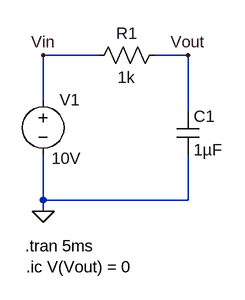
[diagram p0: schematic RC-Parallel.asc]
RC-Parallel.asc, the LTspice schematic file:
Version 4
SHEET 1 880 680
WIRE 208 96 128 96
WIRE 336 96 288 96
WIRE 128 160 128 96
WIRE 336 176 336 96
WIRE 128 304 128 240
WIRE 336 304 336 240
WIRE 336 304 128 304
WIRE 128 320 128 304
FLAG 128 320 0
FLAG 336 96 Vout
FLAG 128 96 Vin
SYMBOL voltage 128 144 R0
WINDOW 3 12 100 Left 2
WINDOW 123 0 0 Left 0
WINDOW 39 0 0 Left 0
SYMATTR InstName V1
SYMATTR Value 10V
SYMBOL res 304 80 R90
WINDOW 0 0 56 VBottom 2
WINDOW 3 32 56 VTop 2
SYMATTR InstName R1
SYMATTR Value 1k
SYMBOL cap 320 176 R0
SYMATTR InstName C1
SYMATTR Value 1µF
SYMATTR SpiceLine V=10
TEXT 102 370 Left 2 !.tran 5ms
TEXT 104 400 Left 2 !.ic V(Vout) = 0

The netlist it stands for:
* RC-Parallel.asc
V1 Vin 0 10V
R1 Vout Vin 1k
C1 Vout 0 1µF V=10
.tran 5ms
.ic V(Vout) = 0
.backanno
.end